# EAGLE design Tag Tracker_v1 (EAGLE 7.3.0)
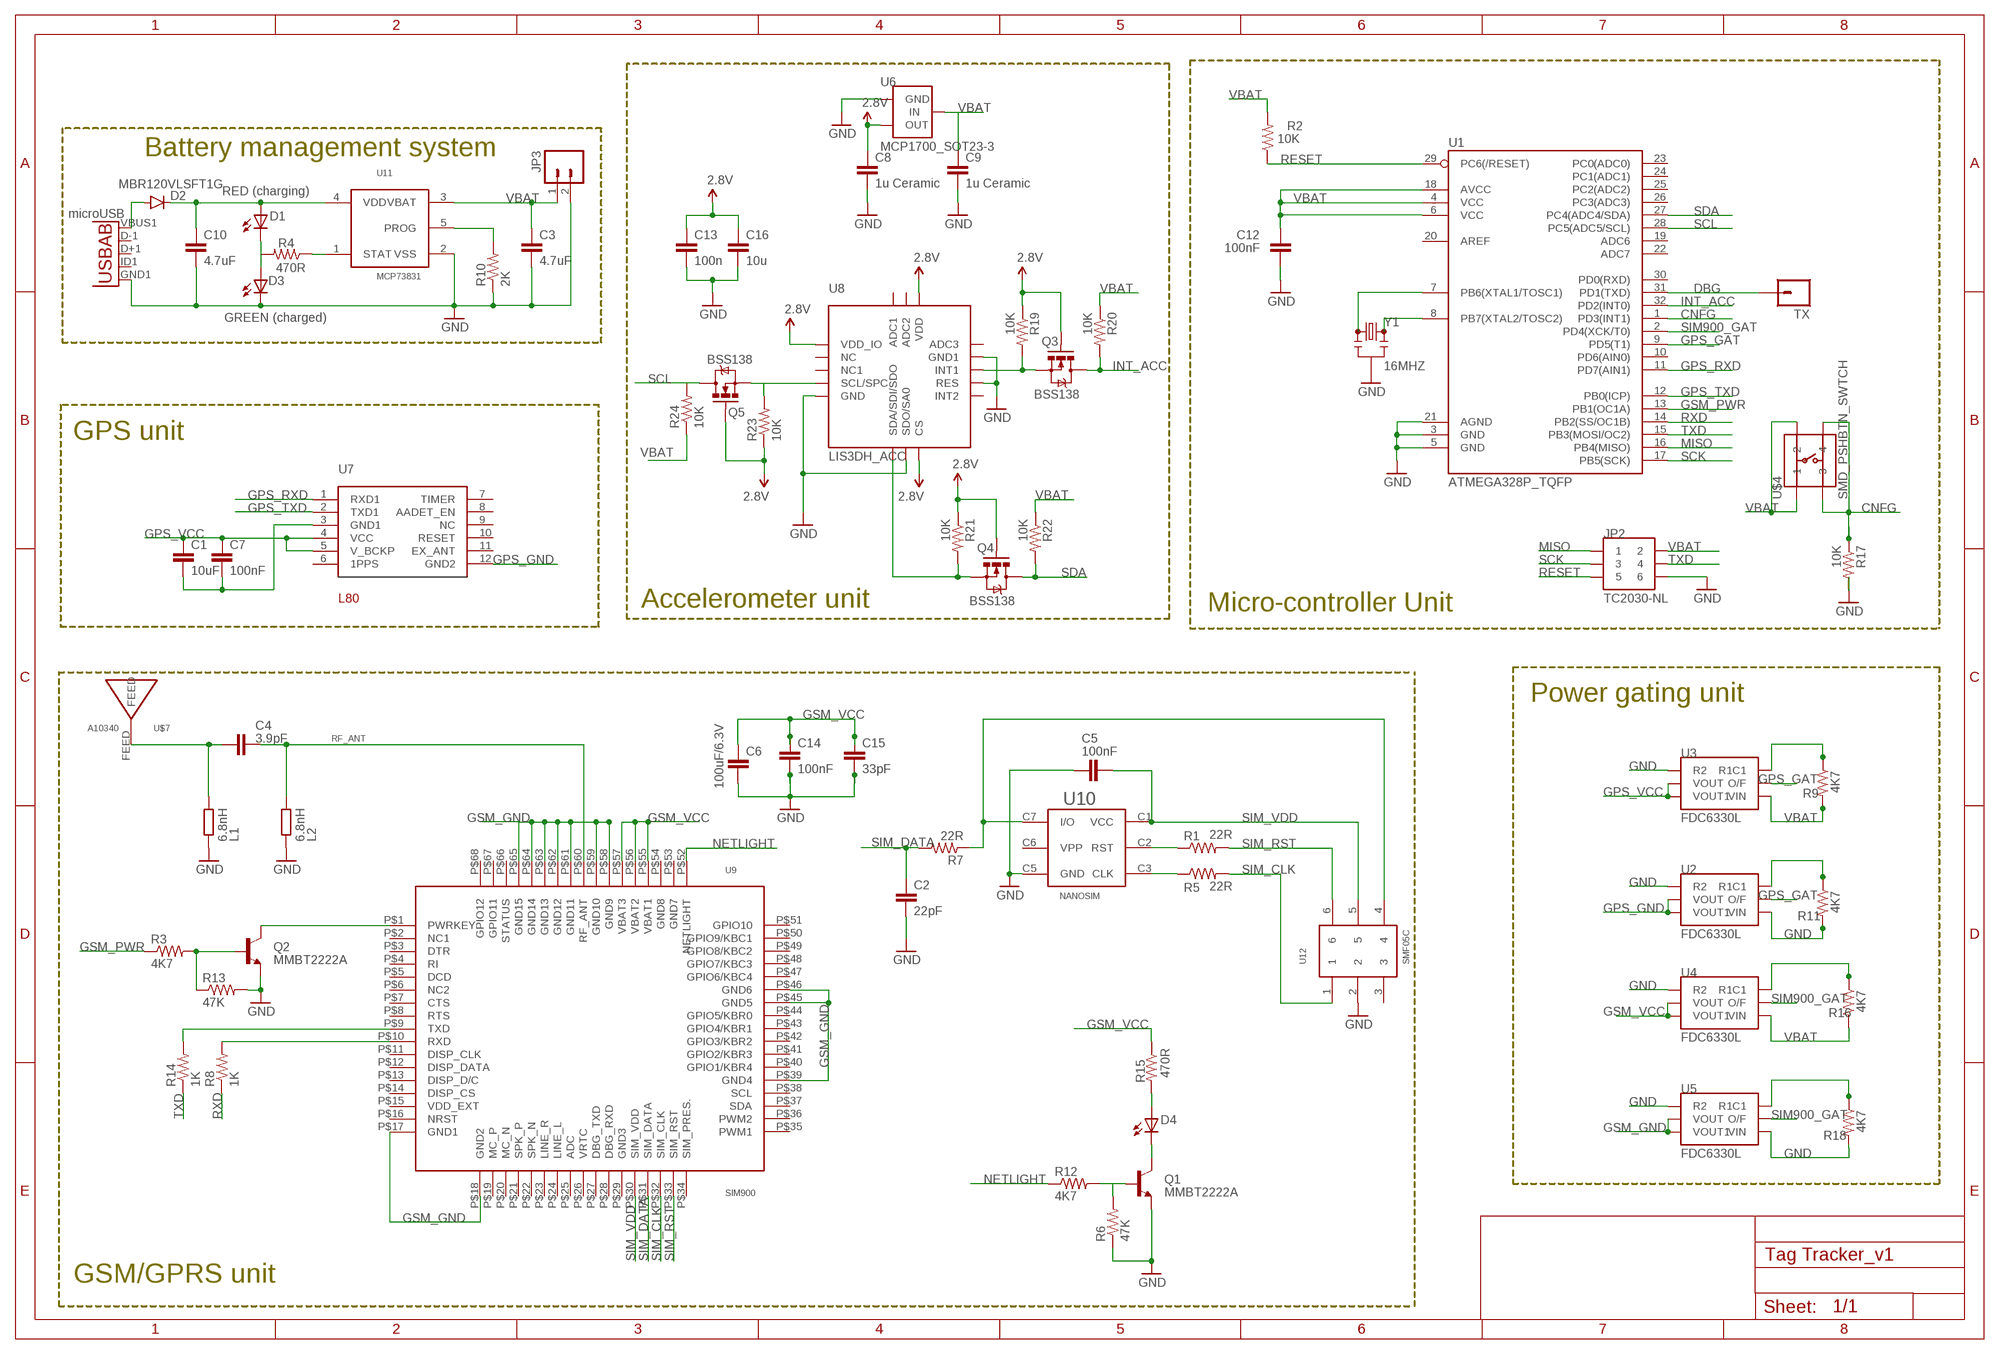
[diagram p0: schematic, sheet 1]

## Parts
C1  10uF  CAP0603-CAP  [0603-CAP]
C2  22pF  CAP0603-CAP  [0603-CAP]
C3  4.7uF  CAP0603-CAP  [0603-CAP]
C4  3.9pF  C-EU0603-RND  [C0603-ROUND]
C5  100nF  CAP0603-CAP  [0603-CAP]
C6  100uF/6.3V  CAP1206  [1206]
C7  100nF  CAP0603-CAP  [0603-CAP]
C8  1u Ceramic  0.1UF-100V-10%(0603)  [0603-CAP]
C9  1u Ceramic  0.1UF-100V-10%(0603)  [0603-CAP]
C10  4.7uF  CAP0603-CAP  [0603-CAP]
C12  100nF  CAP0603-CAP  [0603-CAP]
C13  100n  0.1UF-100V-10%(0603)  [0603-CAP]
C14  100nF  CAP0603-CAP  [0603-CAP]
C15  33pF  CAP0603-CAP  [0603-CAP]
C16  10u  0.1UF-100V-10%(0603)  [0603-CAP]
D1  RED (charging)  LEDSML0603  [SML0603]
D2  MBR120VLSFT1G  DIODESOD123  [SOD-123]
D3  GREEN (charged)  LEDSML0603  [SML0603]
D4  LEDSML0603  [SML0603]
JP2  TC2030-NL  [TC2030-NL]
JP3  M02PTH  [1X02]
L1  6.8nH  R-EU_0603-RND  [R0603-ROUND]
L2  6.8nH  R-EU_0603-RND  [R0603-ROUND]
MICRO_USB  Micro USB  USB-ABCONN-11794  [USB-AB-MICRO-SMD_V03]
Q1  MMBT2222A  TRANSISTOR_NPNMMBT2222A  [SOT23-3]
Q2  MMBT2222A  TRANSISTOR_NPNMMBT2222A  [SOT23-3]
Q3  BSS138  MOSFET-NCHANNELSMD  [SOT23-3]
Q4  BSS138  MOSFET-NCHANNELSMD  [SOT23-3]
Q5  BSS138  MOSFET-NCHANNELSMD  [SOT23-3]
R1  22R  RESISTOR0603-RES  [0603-RES]
R2  10K  RESISTOR0603-RES  [0603-RES]
R3  4K7  RESISTOR0603-RES  [0603-RES]
R4  470R  RESISTOR0603-RES  [0603-RES]
R5  22R  RESISTOR0603-RES  [0603-RES]
R6  47K  RESISTOR0603-RES  [0603-RES]
R7  22R  RESISTOR0603-RES  [0603-RES]
R8  1K  RESISTOR0603-RES  [0603-RES]
R9  4K7  RESISTOR0603-RES  [0603-RES]
R10  2K  RESISTOR0603-RES  [0603-RES]
R11  4K7  RESISTOR0603-RES  [0603-RES]
R12  4K7  RESISTOR0603-RES  [0603-RES]
R13  47K  RESISTOR0603-RES  [0603-RES]
R14  1K  RESISTOR0603-RES  [0603-RES]
R15  470R  RESISTOR0603-RES  [0603-RES]
R16  4K7  RESISTOR0603-RES  [0603-RES]
R17  10K  RESISTOR0603-RES  [0603-RES]
R18  4K7  RESISTOR0603-RES  [0603-RES]
R19  10K  RESISTOR0603-RES  [0603-RES]
R20  10K  RESISTOR0603-RES  [0603-RES]
R21  10K  RESISTOR0603-RES  [0603-RES]
R22  10K  RESISTOR0603-RES  [0603-RES]
R23  10K  RESISTOR0603-RES  [0603-RES]
R24  10K  RESISTOR0603-RES  [0603-RES]
TX  M01PTH  [1X01]
U1  ATMEGA328P_TQFP  [TQFP32-08]
U2  FDC6330L  [FDC6330L]
U3  FDC6330L  [FDC6330L]
U4  FDC6330L  [FDC6330L]
U5  FDC6330L  [FDC6330L]
U6  MCP1700_SOT23-3  [MCP1700_SOT23-3]
U7  L80  [L80]
U8  LIS3DH_ACC  [LIS3DH_ACC]
U9  SIM900  [SIM900]
U10  NANOSIM  [NANOSIM]
U11  MCP73831  [SOT23-5]
U12  SMF05C  [SC70-6]
U$4  SMD_PSHBTN_SWTCH  [KPT-1187B]
U$7  A10340  CALVUS_5BAND_SMD_A103400MM_EXCLUSION  [CALVUS_5BAND_SMD_A10340_0MM_EXCLUSION]
Y1  16MHZ  RESONATOR16MHZ  [RESONATOR-SMD]

## Nets
2.8V: C8.1 C13.1 C16.1 Q3.1(G) Q4.1(G) Q5.1(G) R19.1 R21.1 R23.1 U6.P$2(OUT) U8.P$1(VDD_IO) U8.P$8(CS) U8.P$14(VDD)
CNFG: R17.1 U1.1(PD3(INT1)) U$4.P$3 U$4.P$4
DBG: TX.1 U1.31(PD1(TXD))
GND: C2.2 C3.2 C5.2 C6.2 C8.2 C9.2 C10.2 C12.2 C13.2 C14.2 C15.2 C16.2 D3.C JP2.P$6 JP3.2 L1.1 L2.1 MICRO_USB.GND1(GND) Q1.2(E) Q2.2(E) R6.1 R10.1 R11.2 R13.2 R17.2 R18.2 U1.3(GND) U1.5(GND) U1.21(AGND) U2.P$1(R2) U2.P$4(VIN) U3.P$1(R2) U4.P$1(R2) U5.P$1(R2) U5.P$4(VIN) U6.P$1(GND) U8.P$5(GND) U8.P$7(SDO/SA0) U8.P$10(RES) U8.P$12(GND1) U10.C5(GND) U11.2(VSS) U12.2 Y1.2
GPS_GAT: U1.9(PD5(T1)) U2.P$5(O/F) U3.P$5(O/F)
GPS_GND: C1.2 C7.2 U2.P$2(VOUT) U2.P$3(VOUT1) U7.3(GND1) U7.12(GND2)
GPS_RXD: U1.11(PD7(AIN1)) U7.1(RXD1)
GPS_TXD: U1.12(PB0(ICP)) U7.2(TXD1)
GPS_VCC: C1.1 C7.1 U3.P$2(VOUT) U3.P$3(VOUT1) U7.4(VCC) U7.5(V_BCKP)
GSM_GND: U5.P$2(VOUT) U5.P$3(VOUT1) U9.P$17(GND1) U9.P$18(GND2) U9.P$39(GND4) U9.P$45(GND5) U9.P$46(GND6) U9.P$58(GND9) U9.P$59(GND10) U9.P$61(GND11) U9.P$62(GND12) U9.P$63(GND13) U9.P$64(GND14) U9.P$65(GND15)
GSM_PWR: R3.1 U1.13(PB1(OC1A))
GSM_VCC: C6.1 C14.1 C15.1 R15.1 U4.P$2(VOUT) U4.P$3(VOUT1) U9.P$55(VBAT1) U9.P$56(VBAT2) U9.P$57(VBAT3)
INT_ACC: Q3.3(D) R20.2 U1.32(PD2(INT0))
MISO: JP2.P$1 U1.16(PB4(MISO))
N$1: R7.1 U10.C7(I/O) U12.4
N$2: Q2.1(B) R3.2 R13.1
N$3: R1.1 U10.C2(RST)
N$5: U1.8(PB7(XTAL2/TOSC2)) Y1.3
N$7: R5.1 U10.C3(CLK)
N$8: U1.7(PB6(XTAL1/TOSC1)) Y1.1
N$9: R9.1 U3.P$6(R1C1)
N$10: R8.2 U9.P$10(RXD)
N$12: R14.2 U9.P$9(TXD)
N$13: Q2.3(C) U9.P$1(PWRKEY)
N$14: R4.1 U11.1(STAT)
N$15: R11.1 U2.P$6(R1C1)
N$16: R10.2 U11.5(PROG)
N$17: D1.C D3.A R4.2
N$18: D2.A MICRO_USB.VBUS1(VBUS)
N$20: C4.2 L1.2 U$7.FEED
N$22: C10.1 D1.A D2.C U11.4(VDD)
N$27: Q1.1(B) R6.2 R12.2
N$30: R16.1 U4.P$6(R1C1)
N$39: R18.1 U5.P$6(R1C1)
N$40: D4.C Q1.3(C)
N$41: D4.A R15.2
N$43: Q3.2(S) R19.2 U8.P$11(INT1)
N$46: Q4.2(S) R21.2 U8.P$6(SDA/SDI/SDO)
N$48: Q5.2(S) R23.2 U8.P$4(SCL/SPC)
NETLIGHT: R12.1 U9.P$52(NETLIGHT)
RESET: JP2.P$5 R2.1 U1.29(PC6(/RESET))
RF_ANT [PWR]: C4.1 L2.2 U9.P$60(RF_ANT)
RXD: R8.1 U1.14(PB2(SS/OC1B))
SCK: JP2.P$3 U1.17(PB5(SCK))
SCL: Q5.3(D) R24.2 U1.28(PC5(ADC5/SCL))
SDA: Q4.3(D) R22.2 U1.27(PC4(ADC4/SDA))
SIM900_GAT: U1.2(PD4(XCK/T0)) U4.P$5(O/F) U5.P$5(O/F)
SIM_CLK: R5.2 U9.P$32(SIM_CLK) U12.1
SIM_DATA: C2.1 R7.2 U9.P$31(SIM_DATA)
SIM_RST: R1.2 U9.P$33(SIM_RST) U12.6
SIM_VDD: C5.1 U9.P$30(SIM_VDD) U10.C1(VCC) U12.5
TXD: JP2.P$4 R14.1 U1.15(PB3(MOSI/OC2))
VBAT: C3.1 C9.1 C12.1 JP2.P$2 JP3.1 R2.2 R9.2 R16.2 R20.1 R22.1 R24.1 U1.4(VCC) U1.6(VCC) U1.18(AVCC) U3.P$4(VIN) U4.P$4(VIN) U6.P$3(IN) U11.3(VBAT) U$4.P$1 U$4.P$2
Unconnected: MICRO_USB.D+1(D+) MICRO_USB.D-1(D-) MICRO_USB.ID1(USBID) U1.10(PD6(AIN0)) U1.19(ADC6) U1.20(AREF) U1.22(ADC7) U1.23(PC0(ADC0)) U1.24(PC1(ADC1)) U1.25(PC2(ADC2)) U1.26(PC3(ADC3)) U1.30(PD0(RXD)) U7.6(1PPS) U7.7(TIMER) U7.8(AADET_EN) U7.9(NC) U7.10(RESET) U7.11(EX_ANT) U8.P$2(NC) U8.P$3(NC1) U8.P$9(INT2) U8.P$13(ADC3) U8.P$15(ADC2) U8.P$16(ADC1) U9.P$2(NC1) U9.P$3(DTR) U9.P$4(RI) U9.P$5(DCD) U9.P$6(NC2) U9.P$7(CTS) U9.P$8(RTS) U9.P$11(DISP_CLK) U9.P$12(DISP_DATA) U9.P$13(DISP_D/C) U9.P$14(DISP_CS) U9.P$15(VDD_EXT) U9.P$16(NRST) U9.P$19(MC_P) U9.P$20(MC_N) U9.P$21(SPK_P) U9.P$22(SPK_N) U9.P$23(LINE_R) U9.P$24(LINE_L) U9.P$25(ADC) U9.P$26(VRTC) U9.P$27(DBG_TXD) U9.P$28(DBG_RXD) U9.P$29(GND3) U9.P$34(SIM_PRES.) U9.P$35(PWM1) U9.P$36(PWM2) U9.P$37(SDA) U9.P$38(SCL) U9.P$40(GPIO1/KBR4) U9.P$41(GPIO2/KBR3) U9.P$42(GPIO3/KBR2) U9.P$43(GPIO4/KBR1) U9.P$44(GPIO5/KBR0) U9.P$47(GPIO6/KBC4) U9.P$48(GPIO7/KBC3) U9.P$49(GPIO8/KBC2) U9.P$50(GPIO9/KBC1) U9.P$51(GPIO10) U9.P$53(GND7) U9.P$54(GND8) U9.P$66(STATUS) U9.P$67(GPIO11) U9.P$68(GPIO12) U10.C6(VPP) U12.3

## Notes on the sheet
- Battery management system
- microUSB
- GPS unit
- Accelerometer unit | Micro-controller Unit
- Power gating unit
- RF_ANT
- GSM/GPRS unit

## Library data of the parts
C1-C3 C5-C7 C10 C12 C14 C15 = SparkFun-Capacitors:CAP: Capacitor Standard 0603 ceramic capacitor, and 0.1" leaded capacitor.
C4 = SmartPrj:C-EU: CAPACITOR, European symbol; OC_FARNELL: unknown
C8 C9 C13 C16 = SparkFun-Capacitors:0.1UF-100V-10%(0603): CAP-08390; PROD_ID: CAP-08390; VALUE: 0.1uF
D1 D3 D4 = led:LED: LED OSRAM: - CHIPLED LG R971, LG N971, LY N971, LG Q971, LY Q971, LO R971, LY R971 LH N974, LH R974 LS Q976, LO Q976, LY Q976 LO Q996 - Hyper CHIPLED LW Q18S LB Q993, LB Q99A, LB R99A - SideLED LS A670, LO A670, LY A670, LG A670, LP A670 LB A673, LV A673, LT A673, LW A673 LH A674 LY A675 LS A676, LA A676, LO A676, LY A676, LW A676 LS A679, LY A679, LG A679 - Hyper Micro SIDELED® LS Y876, LA Y876, LO Y876, LY Y876 LT Y87S - SmartLED LW L88C, LW L88S LB L89C, LB L89S, LG L890 LS L89K, LO L89K, LY L89K LS L896, LA L896, LO L896, LY L896 - TOPLED LS T670, LO T670, LY T670, LG T670, LP T670 LSG T670, LSP T670, LSY T670, LOP T670, LYG T670 LG T671, LOG T671, LSG T671 LB T673, LV T673, LT T673, LW T673 LH T674 LS T676, LA T676, LO T676, LY T676, LB T676, LH T676, LSB T676, LW T676 LB T67C, LV T67C, LT T67C, LS T67K, LO T67K, LY T67K, LW E67C LS E67B, LA E67B, LO E67B, LY E67B, LB E67C, LV E67C, LT E67C LW T67C LS T679, LY T679, LG T679 LS T770, LO T770, LY T770, LG T770, LP T770 LB T773, LV T773, LT T773, LW T773 LH T774 LS E675, LA E675, LY E675, LS T675 LS T776, LA T776, LO T776, LY T776, LB T776 LHGB T686 LT T68C, LB T68C - Hyper Mini TOPLED® LB M676 - Mini TOPLED Santana® LG M470 LS M47K, LO M47K, LY M47K Source: http://www.osram.convergy.de LUXEON: - LUMILED® LXK2-PW12-R00, LXK2-PW12-S00, LXK2-PW14-U00, LXK2-PW14-V00 LXK2-PM12-R00, LXK2-PM12-S00, LXK2-PM14-U00 LXK2-PE12-Q00, LXK2-PE12-R00, LXK2-PE12-S00, LXK2-PE14-T00, LXK2-PE14-U00 LXK2-PB12-K00, LXK2-PB12-L00, LXK2-PB12-M00, LXK2-PB14-N00, LXK2-PB14-P00, LXK2-PB14-Q00 LXK2-PR12-L00, LXK2-PR12-M00, LXK2-PR14-Q00, LXK2-PR14-R00 LXK2-PD12-Q00, LXK2-PD12-R00, LXK2-PD12-S00 LXK2-PH12-R00, LXK2-PH12-S00 LXK2-PL12-P00, LXK2-PL12-Q00, LXK2-PL12-R00 Source: www.luxeon.com KINGBRIGHT: KA-3528ASYC Source: www.kingbright.com
D2 = SparkFun-DiscreteSemi:DIODE: Diode These are standard reverse protection diodes and small signal diodes. SMA package can handle up to about 1A. SOD-323 can handle about 200mA. What the SOD-323 package when ordering, there are some mfgs out there that are 5-pin packages.
JP2 = Various_parts:TC2030-NL
JP3 = SparkFun-Connectors:M02: Standard 2-pin 0.1" header. Use with - straight break away headers ( PRT-00116) - right angle break away headers (PRT-00553) - swiss pins (PRT-00743) - machine pins (PRT-00117) - female headers (PRT-00115) Molex polarized connector foot print use with: PRT-08233 with associated crimp pins and housings. 2.54_SCREWTERM for use with PRT-10571. 3.5mm Screw Terminal footprints for PRT-08084 5mm Screw Terminal footprints for use with PRT-08432
L1 L2 = SmartPrj:R-EU_: RESISTOR, European symbol; OC_FARNELL: unknown
MICRO_USB = SparkFun-Connectors:USB-AB: This is a USB AB connector that is compatible with USB OTG. i.e. this connector can serve as a host or device; PROD_ID: CONN-11794
Q1 Q2 = SparkFun-DiscreteSemi:TRANSISTOR_NPN: Generic NPN BJT MMBT2222A - TRANS-08049 (SOT-23, 1A 40V) MPSA42 - TRANS-09116 (SOT-23, 500mA 300V) MMBT5088LT1G - TRANS-11160 (SOT-23, 50 mA 30V) BC547 - COM-08928 <http://www.sparkfun.com/products/8928> (TO-92 45V 100mA) (1.Collector 2.Base 3.Emitter) 2N3904 - COM-00521 <http://www.sparkfun.com/products/521> (TO-92 40V 200mA) (1.Emitter 2.Base 3.Collector) P2N2222A - COM-12852 <http://www.sparkfun.com/products/12852> (TO-92 40V 600mA) (1.Collector 2.Base 3.Emitter); PROD_ID: TRANS-08049
Q3-Q5 = SparkFun:MOSFET-NCHANNEL
R1-R6 R8 R10 R12-R15 = SparkFun-Resistors:RESISTOR: Resistor Basic schematic elements and footprints for 0603, 1206, and PTH resistors.
R7 R9 R11 R16-R18 = SparkFun-Resistors:RESISTOR: Resistor Basic schematic elements and footprints for 0603, 1206, and PTH resistors.; OC_FARNELL: unknown
R19-R24 = SparkFun:RESISTOR: Resistor Basic schematic elements and footprints for 0603, 1206, and PTH resistors.
TX = SparkFun-Connectors:M01: Header 1 Standard 1-pin 0.1" header. Use with straight break away headers (SKU : PRT-00116), right angle break away headers (PRT-00553), swiss pins (PRT-00743), machine pins (PRT-00117), and female headers (PRT-00115). SMTSO-256-ET is a "flush mount" nut for a 4-40 screw. The older package used to be too tight, and did not allow it to sit properly thru the drill hit. The latest (0.165DIA) fits nice and snug.
U1 = SparkFun-DigitalIC:ATMEGA328P_TQFP; PROD_ID: IC-09069
U2-U5 = Various_parts:FDC6330L; OC_MOUSER: 512-FDC6330L
U6 = Various_parts:MCP1700_SOT23-3; OC_MOUSER: 579-MCP1700T3302E/TT
U7 = myLibraries:L80
U8 = Various_parts:LIS3DH_ACC; OC_MOUSER: 511-LIS3DHTR
U9 = myLibraries:SIM900
U10 = myLibraries:NANOSIM
U11 = myLibraries:MCP73831
U12 = myLibraries:SMF05C
U$4 = Sensor_Node:SMD_PSHBTN_SWTCH: SMD Mini Pushbutton Switch (https://www.sparkfun.com/products/8720) Created 12 February 2015 by Bojan Jovanovic; OC_SPARKFUN: COM-08720
U$7 = SmartPrj:CALVUS_5BAND_SMD_A10340; OC_FARNELL: unknown
Y1 = myLibraries:RESONATOR: Resonator Small SMD resonator. Used, eg, on the Arduino Pro/ Pro Mini boards. 8MHz- XTAL-08895 16MHz- XTAL-08900; PROD_ID: XTAL-08900

## Net classes
1 PWR: width 0.203 mm, drill 0.4 mm, clearance 0.076 mm
4 antenna: clearance 0.61 mm

## Board
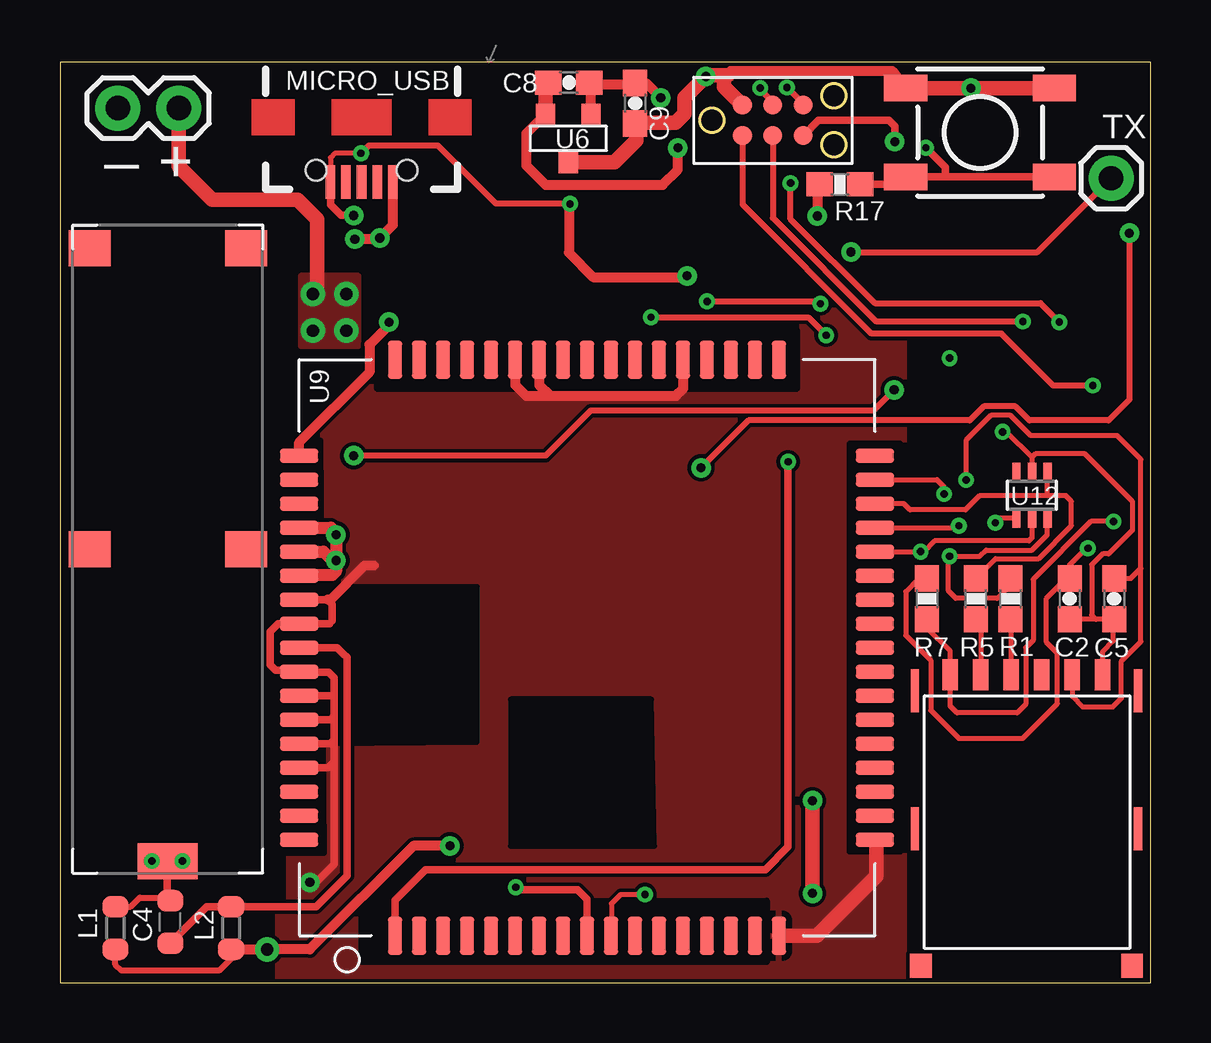
[diagram p1: board, top side]
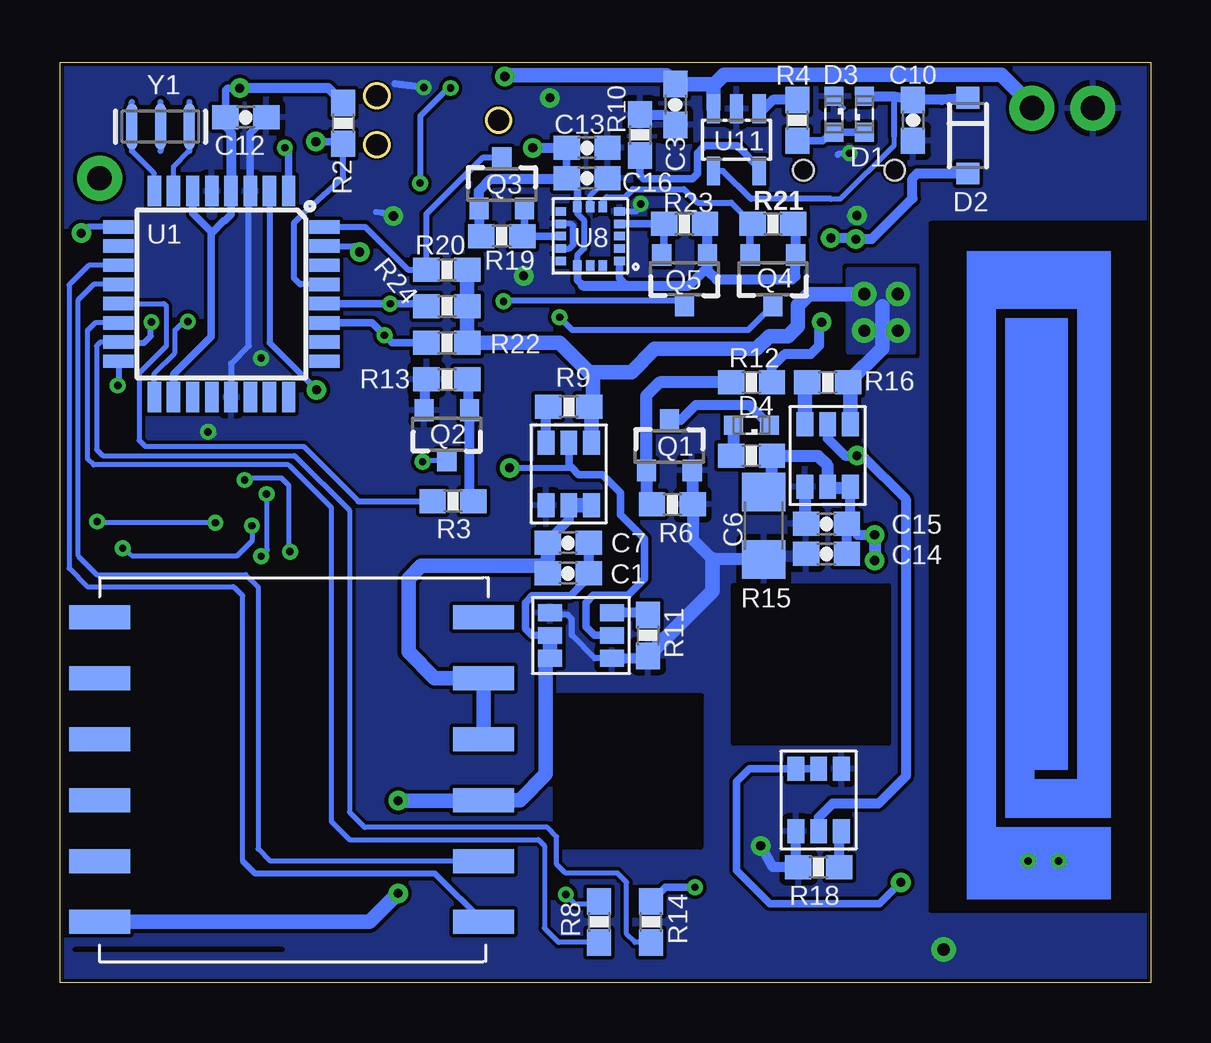
[diagram p2: board, bottom side, seen from below]

Size 45.47 x 38.35 mm. Coordinates in mm from the lower left corner, seen from the top.
Outline: 0,0 45.47,0 45.47,38.35 0,38.35 0,0
Copper layers (1*16): Top 0.035mm / dielectric 1.5mm / Bottom 0.035mm
Design rules "Micron20": minimum track width 8mil, minimum drill 12mil, track to track 6mil, track to pad 6mil, pad to pad 6mil, via to via 6mil, smd to smd 6mil, copper to edge 6mil, drill to drill 6mil, minimum pad ring 7mil, minimum via ring 7mil, stop-mask expansion 4mil, vias tented up to drill 25mil, thermal gap 10mil
bRestrict: area 40.4,34.8 to 40.9,36.6; area 41.7,34.8 to 42.2,36.6

### Footprints (pad centres in the part's own frame; a part is rotated, then mirrored left to right if it is on the bottom)
0603-CAP = smd 1.1 x 1: 1 -0.85,0; 2 0.85,0
C0603-ROUND = smd 0.898 x 1.1: 1 -0.889,0; 2 0.889,0
1206 = smd 1.6 x 1.8: 1 -1.4,0; 2 1.4,0
SML0603 = smd 0.8 x 0.8: A 0.75,0; C -0.75,0
SOD-123 = smd 0.9 x 0.95: A 1.575,0; C -1.575,0
TC2030-NL = smd 0.8 x 0.8: P$1 -1.27,-0.635; P$2 -1.27,0.635; P$3 0,-0.635; P$4 0,0.635; P$5 1.27,-0.635; P$6 1.27,0.635 | hole 1: -2.54,0; 2.54,1.016; 2.54,-1.016
1X02 = drill 1.016 pad 1.88: 1 0,0; 2 2.54,0
R0603-ROUND = smd 0.898 x 1.1: 1 -0.889,0; 2 0.889,0
USB-AB-MICRO-SMD_V03 = smd 1.4 x 0.4: D+1 2.7,0; D-1 2.7,0.65; GND1 2.7,-1.3; ID1 2.7,-0.65; VBUS1 2.7,1.3 | hole 0.85: 2.2,1.9; 2.2,-1.9
SOT23-3 = smd 0.8 x 0.9: 1 -0.95,-1; 2 0.95,-1; 3 0,1.1
0603-RES = smd 1.1 x 1: 1 -0.85,0; 2 0.85,0
1X01 = drill 1.016 pad 1.88: 1 0,0
TQFP32-08 = smd 1.27 x 0.559: 1 -4.293,2.8; 2 -4.293,2; 3 -4.293,1.2; 4 -4.293,0.4; 5 -4.293,-0.4; 6 -4.293,-1.2; 7 -4.293,-2; 8 -4.293,-2.8; 17 4.293,-2.8; 18 4.293,-2; 19 4.293,-1.2; 20 4.293,-0.4; 21 4.293,0.4; 22 4.293,1.2; 23 4.293,2; 24 4.293,2.8 | smd 0.559 x 1.27: 9 -2.8,-4.293; 10 -2,-4.293; 11 -1.2,-4.293; 12 -0.4,-4.293; 13 0.4,-4.293; 14 1.2,-4.293; 15 2,-4.293; 16 2.8,-4.293; 25 2.8,4.293; 26 2,4.293; 27 1.2,4.293; 28 0.4,4.293; 29 -0.4,4.293; 30 -1.2,4.293; 31 -2,4.293; 32 -2.8,4.293
FDC6330L = smd 0.7 x 1: P$1 -0.95,-1.3; P$2 0,-1.3; P$3 0.95,-1.3; P$4 0.95,1.3; P$5 0,1.3; P$6 -0.95,1.3
MCP1700_SOT23-3 = smd 0.8 x 0.9: P$1 0.95,2; P$2 -0.95,2; P$3 0,0
L80 = smd 2.54 x 1: 1 8,-6.35; 2 8,-3.81; 3 8,-1.27; 4 8,1.27; 5 8,3.81; 6 8,6.35; 7 -8,6.35; 8 -8,3.81; 9 -8,1.27; 10 -8,-1.27; 11 -8,-3.81; 12 -8,-6.35
LIS3DH_ACC = smd 0.45 x 0.35: P$1 -1.225,1.03; P$2 -1.225,0.515; P$3 -1.225,0; P$4 -1.225,-0.515; P$5 -1.225,-1.03; P$9 1.225,-1.03; P$10 1.225,-0.515; P$11 1.225,0; P$12 1.225,0.515; P$13 1.225,1.03 | smd 0.35 x 0.45: P$6 -0.53,-1.225; P$7 0,-1.225; P$8 0.53,-1.225; P$14 0.53,1.225; P$15 0,1.225; P$16 -0.53,1.225
SIM900 = smd 1.6 x 0.6: P$1 -12,8; P$2 -12,7; P$3 -12,6; P$4 -12,5; P$5 -12,4; P$6 -12,3; P$7 -12,2; P$8 -12,1; P$9 -12,0; P$10 -12,-1; P$11 -12,-2; P$12 -12,-3; P$13 -12,-4; P$14 -12,-5; P$15 -12,-6; P$16 -12,-7; P$17 -12,-8; P$35 12,-8; P$36 12,-7; P$37 12,-6; P$38 12,-5; P$39 12,-4; P$40 12,-3; P$41 12,-2; P$42 12,-1; P$43 12,0; P$44 12,1; P$45 12,2; P$46 12,3; P$47 12,4; P$48 12,5; P$49 12,6; P$50 12,7; P$51 12,8 | smd 0.6 x 1.6: P$18 -8,-12; P$19 -7,-12; P$20 -6,-12; P$21 -5,-12; P$22 -4,-12; P$23 -3,-12; P$24 -2,-12; P$25 -1,-12; P$26 0,-12; P$27 1,-12; P$28 2,-12; P$29 3,-12; P$30 4,-12; P$31 5,-12; P$32 6,-12; P$33 7,-12; P$34 8,-12; P$52 8,12; P$53 7,12; P$54 6,12; P$55 5,12; P$56 4,12; P$57 3,12; P$58 2,12; P$59 1,12; P$60 0,12; P$61 -1,12; P$62 -2,12; P$63 -3,12; P$64 -4,12; P$65 -5,12; P$66 -6,12; P$67 -7,12; P$68 -8,12
NANOSIM = smd 0.65 x 1.3: C1 1.905,6.42; C2 -0.635,6.42; C3 -1.905,6.42; C5 3.175,6.42; C6 0.635,6.42; C7 -3.175,6.42 | smd 0.35 x 1.8: P$7 -4.65,0; P$8 4.65,0; P$9 -4.65,5.75; P$10 4.65,5.75 | smd 0.9 x 1: P$11 -4.4,-5.72; P$12 4.4,-5.72
SOT23-5 = smd 0.55 x 1.2: 1 -0.95,-1.3; 2 0,-1.3; 3 0.95,-1.3; 4 0.95,1.3; 5 -0.95,1.3
SC70-6 = smd 0.35 x 0.8: 1 -0.65,-0.95; 2 0,-0.95; 3 0.65,-0.95; 4 0.65,0.95; 5 0,0.95; 6 -0.65,0.95
KPT-1187B = smd 1.8 x 1.1: P$1 -3.1,1.85; P$2 3.1,1.85; P$3 -3.1,-1.85; P$4 3.1,-1.85
CALVUS_5BAND_SMD_A10340_0MM_EXCLUSION = smd 2.5 x 1.5: FEED 3.95,0.5 | smd 1.75 x 1.5: FIXINGPOINT$1 0.7,26.05; FIXINGPOINT$2 7.22,26.05; FIXINGPOINT$3 0.7,13.49; FIXINGPOINT$4 7.22,13.49
RESONATOR-SMD = smd 0.45 x 1.905: 1 -1.2,0; 2 0,0; 3 1.2,0

### Placement (x,y rotation side)
C1  24.28,17.07 0 bottom
C2  42.09,16 270 top
C3  19.81,36.6 270 bottom
C4  4.6,2.54 90 top
C5  43.94,16 270 top
C6  16.13,19.05 270 bottom
C7  24.28,18.34 0 bottom
C8  21.21,37.52 0 top
C9  23.98,36.65 90 top
C10  9.91,35.94 270 bottom
C12  37.72,36.07 0 bottom
C13  23.5,34.8 0 bottom
C14  13.51,17.88 180 bottom
C15  13.51,19.13 180 bottom
C16  23.5,33.53 0 bottom
D1  11.94,36.2 90 bottom
D2  7.62,35.31 270 bottom
D3  13.21,36.2 270 bottom
D4  16.64,23.24 180 bottom
JP2  29.72,35.94 0 top
JP3  4.95,36.45 180 top
L1  2.31,2.29 90 top
L2  7.14,2.29 90 top
MICRO_USB  12.57,36.07 270 top
Q1  20.07,22.35 0 bottom
Q2  29.34,22.86 180 bottom
Q3  27.05,33.27 0 bottom
Q4  15.75,29.34 180 bottom
Q5  19.43,29.34 180 bottom
R1  39.62,16 90 top
R2  33.66,35.81 90 bottom
R3  29.08,20.07 0 bottom
R4  14.73,35.94 270 bottom
R5  38.18,16 90 top
R6  19.94,19.94 180 bottom
R7  36.14,16 90 top
R8  22.99,2.54 90 bottom
R9  24.26,24 0 bottom
R10  21.29,35.33 270 bottom
R11  20.95,14.48 270 bottom
R12  16.64,25.02 180 bottom
R13  29.34,25.15 180 bottom
R14  20.83,2.54 90 bottom
R15  16.64,21.97 180 bottom
R16  13.46,25.02 0 bottom
R17  32.51,33.27 180 top
R18  13.84,4.83 180 bottom
R19  27.05,31.11 0 bottom
R20  29.34,29.72 180 bottom
R21  15.75,31.62 180 bottom
R22  29.34,26.67 180 bottom
R23  19.43,31.62 180 bottom
R24  29.34,28.19 180 bottom
TX  43.81,33.53 0 top
U1  38.73,28.7 270 bottom
U2  23.75,14.48 270 bottom
U3  24.26,21.21 0 bottom
U4  13.46,21.97 0 bottom
U5  13.84,7.62 180 bottom
U6  21.18,34.19 0 top
U7  35.81,8.89 0 bottom
U8  23.37,31.11 180 bottom
U9  21.97,13.97 90 top
U10  40.28,6.43 0 top
U11  17.27,35.13 180 bottom
U12  40.51,20.32 180 top
U$4  38.35,35.43 0 top
U$7  0.53,4.57 0 top
Y1  41.27,35.69 180 bottom

### Tracks (layer width: path | path; a pad name or v marks a point on that pad's centre or on a via)
2.8V  (via drill 0.38 pad 0.81)
  Top 0.406: v25.76,34.8 25.76,33.88 25.12,33.25 20.24,33.25 19.43,34.06 19.43,35.39 U6.P$2
  Top 0.61: U6.P$2 20.23,37.39 C8.1
  Bottom 0.254: R23.1 18.56,31.6 | U8.P$14 23.9,30.33 23.62,30.61 23.62,31.77 23.9,32.05 U8.P$8
  Bottom 0.305: 14.8,31.52 R21.1 | U8.P$14 23.9,29.28 23.67,29.06 | U8.P$1 22.14,29.36 21.84,29.06 | U8.P$8 23.9,33.08 C16.1 C13.1
  Bottom 0.406: 14.8,31.52 Q4.1 14.81,30.33 14.81,29.44 14.94,29.31 18.11,29.31 18.48,29.68 18.48,29.82 | 18.48,29.82 Q5.1 18.48,31.52 R23.1 | 23.67,29.06 21.84,29.06 19.24,29.06 18.48,29.82 | C16.1 24.34,33.48 27.53,33.48 28.02,32.99 28.02,32.29 Q3.1 28,31.21 R19.1 | v25.76,34.8 C13.1
CNFG  (via drill 0.3 pad 0.61)
  Top 0.305: U$4.P$3 34.95,33.27 R17.1 | U$4.P$4 36.91,33.58 | 36.91,33.58 U$4.P$3 | U$4.P$3 35.25,33.96 | v36.09,34.8 36.91,33.98 36.91,33.58
  Bottom 0.305: v36.09,34.8 35.94,34.64 U1.1
DBG  (via drill 0.38 pad 0.81)
  Top 0.254: v32.97,30.45 40.74,30.45 TX.1
  Bottom 0.254: U1.31 33.22,30.7 v32.97,30.45
GND  (via drill 0.3 pad 0.51, 0.3 pad 0.61, 0.38 pad 0.81, 0.51 pad 1.02)
  Top 0.203: 40.51,21.89 40.66,22.05 42.72,22.05 44.7,20.07 44.7,18.87 43.71,17.88 43.46,17.88 43,17.42 43,15.33 43.18,15.15 | 40.51,21.89 U12.2 | 40.51,21.89 39.5,22.91 v39.29,22.96 | v12.55,34.57 11.46,34.57 11.28,34.39 MICRO_USB.GND1 | U10.C5 43.46,13.79 43.92,14.25 43.92,15.13 C5.2 43.18,15.15 | 43.18,15.15 C2.2
  Top 0.254: L2.1 7.14,1.02 6.63,0.51 2.56,0.51 2.31,0.76 L1.1 | JP2.P$6 30.99,36.63 v30.3,37.31 | 21.21,32.51 v21.26,32.46 21.23,32.49 18.16,32.49 15.75,34.9 12.88,34.9 v12.55,34.57
  Top 0.305: MICRO_USB.GND1 11.27,32.41 11.71,31.98 v12.24,31.98
  Top 0.406: L2.1 v8.64,1.4 10.41,1.4 14.73,5.71 v16.26,5.71 | U6.P$1 22.13,37.44 | 22.13,37.44 C8.2 | v25.04,36.88 24.42,37.5 C9.2 23.92,37.44 22.13,37.44 | 21.21,32.51 21.21,30.43 22.23,29.41 26.09,29.41 v26.14,29.46 | R17.2 31.57,33.18 v31.57,31.95
  Bottom 0.203: 37.53,33.59 U1.3 37.59,32.94 | v39.29,22.96 39.04,22.91 39.04,22.86 | U8.P$7 23.37,32.8 C16.2 | D3.C 13.3,36.95 12.8,36.45
  Bottom 0.254: 30.24,23.91 Q2.2 | 37.59,32.94 37.59,26.54 38.34,25.8 U1.21 | v31.57,31.95 32.31,32.13 32,32.11 | U8.P$12 24.24,30.6 24.08,30.76 24.08,31.55 24.16,31.63 U8.P$10 | U2.P$4 23.18,13.53 24.13,14.48 24.13,15.16 24.31,15.34 24.96,15.34 U2.P$1 | U8.P$5 21.45,32.15 21.11,32.49 v21.26,32.46 | v12.55,34.57 12.57,34.54 13.03,34.54 13.06,34.52 13.06,34.49
  Bottom 0.305: C12.2 37.53,35.4 U1.3 | v30.3,37.31 31.5,37.47 | v12.24,31.98 12.5,31.98 12.52,31.95
  Bottom 0.406: 30.24,23.91 30.24,25.1 R13.2 | U2.P$4 21.05,13.53 R11.2 | U5.P$4 14.79,4.93 R18.2 15.75,4.83 v16.26,5.71 | v8.64,1.4 8.89,1.4 | v25.04,36.88 25.09,36.88 25.22,36.75 | R10.1 20.24,36.18 C3.2
  Bottom 0.508: U4.P$1 14.41,19.1 | 16,17.53 C6.2 18.26,17.65 19.05,18.44 19.05,19.9 R6.1 19.09,21.32 Q1.2
  Bottom 0.61: R11.2 18.26,16.32 18.26,17.65
  other vias: 37.08,26.04
  pour Bottom (rank 3): 0,38.35 0,0 45.47,0 45.47,1.91 45.47,38.35
GPS_GAT  (via drill 0.38 pad 0.81)
  Top 0.254: v44.58,31.24 44.58,24.31 43.71,23.44 40.41,23.44 39.83,24.03 38.51,24.03 37.92,23.44 28.7,23.44 v26.72,21.46
  Bottom 0.254: U1.9 44.32,31.5 v44.58,31.24 | v26.72,21.46 24.13,21.46
  Bottom 0.305: U3.P$5 24.26,21.59 24.13,21.46 23.85,21.18 22.86,21.18 22.1,20.42 22.1,19.51 21.11,18.52 21.11,16.84 21.79,16.15 23.24,16.15 23.55,15.85 23.55,14.83 23.19,14.48 U2.P$5
GPS_GND  (via drill 0.38 pad 0.81)
  Top 0.61: v31.37,3.73 v31.37,7.59
  Bottom 0.305: C1.2 23.43,16.88 24.18,16.13 25.78,16.13 26.06,15.85 26.06,14.76 25.78,14.48 U2.P$2
  Bottom 0.406: C7.2 C1.2
  Bottom 0.61: U2.P$2 U2.P$3 25.22,13.36 25.22,8.69 26.29,7.62 U7.3 27.84,7.59 v31.37,7.59 | U7.12 32.56,2.54 v31.37,3.73
GPS_RXD
  Bottom 0.203: 37.85,5.08 37.85,16.13 38.23,16.51 44.32,16.51 45.09,17.27 45.09,29.08 44.27,29.9 U1.11
  Bottom 0.254: U7.1 29.83,4.56 37.33,4.56 37.85,5.08
GPS_TXD
  Bottom 0.203: U7.2 36.7,5.08 37.21,5.59 37.21,16.51 37.72,17.02 43.94,17.02 44.7,17.78 44.7,28.47 44.07,29.1 U1.12
GPS_VCC
  Bottom 0.406: 25.17,18.38 24.26,19.29 U3.P$2
  Bottom 0.61: U7.4 U7.5 29.84,12.7 30.94,13.79 30.94,16.84 30.4,17.37 25.44,17.37 | 25.16,17.04 C1.1 25.44,17.37 | U3.P$3 U3.P$2 | 25.17,18.38 C7.1 25.13,17.68 arc90 25.44,17.37
GSM_GND  (via drill 0.38 pad 0.81)
  Top 0.305: U9.P$65 11.18,8.97 11.43,9.22 | 11.43,9.22 11.43,10.13 | 11.43,10.13 11.43,11.12 | 11.43,11.12 11.43,11.97 | 11.43,11.97 11.43,12.72 11.2,12.95 9.99,12.95 U9.P$61 9.91,13.03 8.99,13.03 8.76,13.26 8.76,14.63 9.1,14.97 U9.P$59 11.24,14.97 11.35,15.09 11.35,15.77 11.16,15.97 U9.P$58 | U9.P$63 11.28,10.97 11.43,11.12 | U9.P$64 11.27,9.97 11.43,10.13 | U9.P$62 11.43,11.97 | 11.43,9.22 11.43,4.95 10.67,4.19 v10.41,4.19
  Top 0.406: U9.P$46 18.97,24.92 19.43,24.46 20.42,24.46 | 20.42,24.46 25.68,24.46 25.98,24.77 25.98,25.96 U9.P$39 | U9.P$45 19.97,24.91 20.42,24.46 | 11.16,15.97 11.27,15.97 12.7,17.4 13.08,17.4
  Top 0.61: U9.P$17 31.56,1.97 34.04,4.45 34.04,5.91 U9.P$18
  Bottom 0.305: v10.41,4.19 11.3,3.3 15.88,3.3 17.27,4.7 17.27,8.38 16.73,8.92 U5.P$3 U5.P$2
  pour Top (rank 6): 9.07,28.14 9.07,-0.03 16.89,-0.03 35.2,-0.03 35.2,24.33 35.2,28.12
GSM_PWR
  Bottom 0.203: U1.13 41.13,28.3 41.02,28.19 41.02,26.54 42.16,25.4 42.16,22.61 41.91,22.35 35.31,22.35 33.02,20.07
  Bottom 0.254: 33.02,20.07 R3.1
GSM_VCC  (via drill 0.38 pad 0.81)
  Top 0.508: U9.P$55 11.28,18.97 11.51,18.75 v11.51,17.6 | v11.51,17.6 11.51,17.45 | 11.51,17.45 11.51,17.14 11.35,16.99 9.99,16.99 U9.P$57 | U9.P$56 10.99,17.97 11.35,17.6 | 11.35,17.6 11.51,17.45 | v11.51,17.6 11.35,17.6
  Bottom 0.406: 12.56,20.62 U4.P$3 12.51,19.28 C15.1 | C14.1 C15.1 | C15.1 12.21,18.67 v11.51,18.67
  Bottom 0.508: 12.56,20.62 13.41,20.62 U4.P$2 13.46,21.54 13.87,21.95 15.76,21.95 R15.1 15.79,20.79 C6.1 | 11.58,17.53 v11.51,17.6 v11.51,18.67
INT_ACC
  Bottom 0.254: U1.32 32.75,31.5 30.96,29.72 R20.2 30.2,29.73 30.2,32.03 27.86,34.37 Q3.3
MISO  (via drill 0.3 pad 0.51)
  Top 0.254: v43.05,24.89 41.4,24.89 39.24,27.05 33.83,27.05 28.45,32.44 JP2.P$1
  Bottom 0.203: 43.03,24.92 v43.05,24.89
  Bottom 0.254: U1.16 43.03,24.92
N$1  (via drill 0.3 pad 0.3)
  Top 0.203: U12.4 39.18,19.37 v38.99,19.18 | R7.1 36.14,14.81 37.08,13.87 37.08,12.87 U10.C7 37.11,11.53 37.39,11.25 39.9,11.25 40.26,11.61 40.26,13.97 40.56,14.28 40.56,16.82 42.98,19.23 v43.92,19.23 44.02,19.23
  Bottom 0.203: v38.99,19.18 43.87,19.18 v43.92,19.23
N$2
  Bottom 0.254: 28.44,23.91 Q2.1 28.18,23.66
  Bottom 0.406: 28.44,23.91 28.44,25.1 R13.1 | R3.2 28.39,20.22 Q2.1
N$3
  Top 0.203: U10.C2 39.65,14.85 R1.1
N$5
  Bottom 0.203: U1.8 41.53,33.73 42.48,34.67
N$6
  cutout Top: 18.8,11.81 18.8,5.71 24.77,5.71 24.64,11.81
N$7
  Top 0.203: R5.1 38.38,14.95 U10.C3
N$8
  Bottom 0.203: U1.7 40.73,34.01 40.08,34.67
N$9
  Bottom 0.406: U3.P$6 25.21,24 R9.1
N$10  (via drill 0.3 pad 0.25)
  Top 0.203: v24.38,3.68 23.37,3.68 22.99,3.3 22.99,1.99 U9.P$10
  Bottom 0.203: v24.38,3.68 24,3.3 23.07,3.3 R8.2
N$12  (via drill 0.3 pad 0.25)
  Top 0.305: U9.P$9 21.97,3.48 21.57,3.89 19.1,3.89 v19,3.99
  Bottom 0.305: R14.2 20.23,3.99 v19,3.99
N$13  (via drill 0.3 pad 0.51)
  Top 0.254: U9.P$1
  Top 0.305: U9.P$1 13.97,3.46 15.24,4.72 29.41,4.72 30.35,5.66 v30.35,21.72
  Bottom 0.203: Q2.3 30.31,21.76 v30.35,21.72
N$14
  Bottom 0.406: R4.1 15.76,36.79 16.12,36.43 U11.1
N$15
  Bottom 0.406: R11.1 21.05,15.43 U2.P$6
N$16
  Bottom 0.305: U11.5 16.32,33.98 17.22,34.87 18.59,34.87 18.9,34.57 18.9,33.71 19.1,33.5 21.13,33.5 21.29,33.66 R10.2
N$17
  Bottom 0.305: D1.C D3.A 13.69,35.09 R4.2
N$18  (via drill 0.38 pad 0.81)
  Top 0.406: MICRO_USB.VBUS1 13.87,31.58 13.28,30.99 v12.29,30.99
  Bottom 0.406: D2.A 9.73,33.73 9.93,33.53 9.93,32.69 11.63,30.99 v12.29,30.99 12.34,31.04 v13.34,31.04 13.23,30.94
N$19
  cutout Bottom: 10.95,16.54 10.95,10.01 17.37,10.01 17.37,16.54
N$20
  Top 0.203: U$7.FEED
  Top 0.254: 4.6,4.96 U$7.FEED | L1.2 2.95,3.17 3.33,3.56 4.47,3.56 C4.2
  Top 0.305: 4.47,3.56 U$7.FEED
N$21  (via drill 0.3 pad 0.41)
  other vias: 3.84,5.08
N$22
  Bottom 0.203: 13.34,32.66 12.93,32.66 10.7,34.9 10.7,35.28
  Bottom 0.254: D1.A 11.35,36.95 | 13.34,32.66 16.66,32.66 17.83,33.83 U11.4 | 10.7,35.28 10.7,36.95
  Bottom 0.406: D2.C 8.73,36.79 C10.1 10.7,36.95 D1.A
N$23  (via drill 0.3 pad 0.41)
  other vias: 5.11,5.08
N$24
  cutout Top: 36.32,1.52 44.58,1.52 44.45,1.52
N$25
  cutout Bottom: 18.77,11.94 18.77,5.66 24.79,5.66 24.79,11.96 18.75,11.96
N$27
  Bottom 0.508: R6.2 21.02,20.17 Q1.1 21.03,21.37 21.03,24.46 20.47,25.02 R12.2
N$28
  cutout Bottom: 36.2,1.4 44.83,1.4 44.7,1.4
N$29
  cutout Top: 0.25,31.62 9.27,31.62 9.27,3.05 0.25,3.05
N$30
  Bottom 0.61: U4.P$6 14.41,25.02 R16.1
N$31
  cutout Bottom: 0.25,31.62 9.14,31.62 9.14,3.05 0.25,3.05
N$32
  cutout Top: 12.57,3.43 29.46,3.43 29.46,0.86 12.57,0.86
N$34
  cutout Top: 13.21,27.18 13.21,24.77 30.73,24.77 30.73,27.18
N$35
  cutout Top: 9.04,22.61 10.85,22.61 11,5.41 8.97,5.41
N$36
  cutout Top: 32.89,22.48 32.89,5.46 35.05,5.46 35.05,22.48
N$38
  cutout Top: 10.92,16.51 10.92,9.96 17.4,10.03 17.4,16.51
N$39
  Bottom 0.254: R18.1 13.08,4.83
  Bottom 0.406: U5.P$6 12.99,6.22 R18.1
N$40
  Bottom 0.406: D4.C 16.73,24.08 18.97,24.08 19.6,23.45 Q1.3
N$41
  Bottom 0.508: D4.A 17.39,22.07 R15.2
N$43
  Bottom 0.305: U8.P$11 R19.2 26.1,31.21 Q3.2
N$46
  Bottom 0.254: U8.P$6 22.84,32.59 22.68,32.74 21.92,32.74 21.59,33.07 19.46,33.07 18.9,32.51 17.49,32.51 R21.2
  Bottom 0.305: Q4.2 16.7,31.52 R21.2
N$48
  Bottom 0.305: U8.P$4 R23.2 20.28,30.44 Q5.2
NETLIGHT  (via drill 0.38 pad 0.81)
  Top 0.406: 10.39,21.97 U9.P$52 9.97,22.52 12.9,25.45 12.9,26.59 13.72,27.41 v13.72,27.53
  Bottom 0.406: R12.1 15.79,25.67 15.24,26.21 14.17,26.21 13.82,26.57 13.82,27.43 v13.72,27.53
RESET  (via drill 0.38 pad 0.81)
  Top 0.305: 34.8,35.31 v34.8,35.05 34.8,35.69 34.54,35.94 31.62,35.94 JP2.P$5
  Bottom 0.254: R2.1 33.66,33.55 35.33,32.05 35.71,31.67 35.71,29.36 35.45,29.1 U1.29
  Bottom 0.305: v34.8,35.05 33.74,35.05 R2.1
RF_ANT
  Top 0.305: C4.1 6.12,3.17 L2.2 10.67,3.17 11.96,4.47 11.96,13.56 11.81,13.72 11.56,13.97 U9.P$60
RXD
  Bottom 0.203: U1.14 44,27.5 44.32,27.18 44.32,21.84 44.07,21.59 35.94,21.59 34.16,19.81 34.16,6.73 33.4,5.97 25.53,5.97 25.27,5.71 25.27,2.29 24.68,1.69 R8.1
SCK  (via drill 0.3 pad 0.51)
  Top 0.254: v40.13,27.56 34.04,27.56 29.72,31.88 JP2.P$3
  Bottom 0.203: U1.17 41.53,25.39 40.66,26.26 40.66,27.2 40.31,27.56 v40.13,27.56 40.26,27.43
SCL  (via drill 0.3 pad 0.61)
  Top 0.254: 31.62,28.22 v31.7,28.3 31.6,28.4 v26.98,28.4
  Bottom 0.254: 26.98,28.24 v26.98,28.4 26.8,28.42 19.62,28.42 Q5.3 | v31.7,28.3 30.3,28.3 R24.2
  Bottom 0.305: U1.28 v31.7,28.3 30.19,28.3 R24.2
SDA  (via drill 0.3 pad 0.61)
  Top 0.254: v24.64,27.74 31.19,27.74 v31.94,26.99
  Bottom 0.254: Q4.3 16.78,27.2 24.11,27.2 v24.64,27.74
  Bottom 0.305: U1.27 32.45,27.5 v31.94,26.99 31.62,26.67 R22.2
SIM900_GAT  (via drill 0.38 pad 0.81)
  Top 0.254: v34.77,24.71 33.91,23.85 22.12,23.85 20.24,21.97 v12.24,21.97
  Bottom 0.254: U1.2 36.73,26.68 v34.77,24.71
  Bottom 0.406: U4.P$5 13.46,22.68 12.75,21.97 v12.24,21.97 12.01,21.97 10.21,20.17 10.21,8.61 11.35,7.47 13.26,7.47 13.84,6.88 U5.P$5
SIM_CLK
  Top 0.203: 41.15,20.32 41.15,21.25 U12.1 | 41.15,20.32 38.35,20.32 37.74,19.71 35.43,19.71 35.17,19.97 U9.P$32 | 41.15,20.32 41.91,20.32 42.16,20.07 42.16,19.05 40.79,17.68 39,17.68 R5.2 38.34,16.85
SIM_DATA  (via drill 0.3 pad 0.3)
  Top 0.203: U9.P$31 37.38,18.97 v37.47,19.05 | 42.65,18.14 v42.85,18.11 42.77,18.11 42.09,17.42 C2.1 41.95,16.85 41.12,16.03 41.12,14.2 41.58,13.74 41.58,11.63 40.13,10.19 37.47,10.19 36.3,11.35 36.3,13.44 35.26,14.48 35.26,16.31 35.8,16.85 R7.2
  Bottom 0.203: v37.47,19.05 37.47,18.41 38.1,17.78 42.44,17.78 v42.85,18.11
SIM_RST  (via drill 0.3 pad 0.3)
  Top 0.203: U9.P$33 36.56,20.97 36.83,20.7 v36.85,20.37 | U12.6 41.15,19.36 41.15,18.67 40.51,18.03 38.61,18.03 38.35,17.78 v37.08,17.78 37.03,17.73 37.03,16.33 37.34,16.03 39.06,16.03 39.89,16.85 R1.2
  Bottom 0.203: v37.08,17.78 36.83,18.03 36.83,20.37 v36.85,20.37
SIM_VDD  (via drill 0.3 pad 0.61)
  Top 0.203: U12.5 40.51,18.54 40.39,18.41 36.45,18.41 36,17.97 v35.88,17.97 U9.P$30 | 45.06,17.27 45.06,21.82 44.07,22.81 40.46,22.81 39.62,23.65 38.81,23.65 37.77,22.61 v37.77,20.95 | C5.1 44.64,16.85 45.06,17.27 | U10.C1 42.19,11.94 42.62,11.51 43.89,11.51 44.25,11.86 44.25,13.41 45.06,14.22 45.06,17.27
  Bottom 0.203: v35.88,17.97 35.92,18.01 35.92,20.73 36.22,21.03 37.69,21.03 v37.77,20.95
TXD  (via drill 0.3 pad 0.25, 0.3 pad 0.61)
  Top 0.254: v29.18,37.29 29.72,36.65 JP2.P$4 | v30.45,33.33 30.45,31.83 33.96,28.32 40.87,28.32 v41.66,27.53
  Bottom 0.203: R14.1 21.5,1.69 21.84,2.03 21.84,4.19 22.23,4.57 24.38,4.57 24.77,4.95 24.77,6.1 25.15,6.48 32.77,6.48 33.4,7.11 33.4,19.68 35.69,21.97 43.69,21.97 43.94,22.23 43.94,26.54 43.78,26.7 U1.15 43,26.67
  Bottom 0.254: 30.38,33.12 v30.45,33.33 30.45,36.12 29.29,37.29 v29.18,37.29 | 43,26.67 41.96,26.67 41.68,26.95 41.68,27.51 v41.66,27.53
VBAT  (via drill 0.38 pad 0.81, 0.51 pad 1.02)
  Top 0.406: U$4.P$1 34.69,38 27.96,38 27.79,37.82
  Top 0.61: JP3.1 4.95,34.04 6.35,32.64 9.91,32.64 10.72,31.83 10.72,28.88 v10.54,28.7 | U6.P$3 23.11,34.19 24.03,35.1 24.03,35.75 C9.1 24.02,35.84 25.65,35.84 26.04,36.22 26.04,36.88 v26.92,37.77 26.98,37.82 27.69,37.82 | U$4.P$2 v37.97,37.28 U$4.P$1 | 27.69,37.82 27.79,37.82 27.84,37.82 | JP2.P$2 27.69,37.34 27.69,37.82
  Bottom 0.254: 18.22,37.28 18.22,37.27
  Bottom 0.305: U1.6 39.94,32.06 39.17,31.29 39.17,31.22 | U1.4 38.34,32.02 38.61,31.75 38.63,31.75 39.17,31.22 | 38.34,35.41 38.57,35.65 C12.1 38.57,37.2 38.48,37.28 v37.97,37.28 | U1.18 40.73,25.36 39.17,26.92 39.17,31.22
  Bottom 0.406: 38.34,35.41 U1.4 | R2.2 34.27,37.28 v37.97,37.28
  Bottom 0.61: JP3.1 4.95,36.58 6.22,37.85 17.78,37.85 18.22,37.4 | U11.3 18.22,37.27 | 18.22,37.28 18.22,37.4 | v26.92,37.77 26.87,37.82 20.18,37.82 C3.1 18.27,37.45 18.22,37.4 | 11.18,28.19 11.18,26.45 R16.2 12.51,25.02 U4.P$4 | U3.P$4 23.31,23.9 arc-90 R9.2 23.24,24.17 23.24,25.44 | R20.1 R24.1 R22.1 24.64,26.67 23.41,25.44 23.24,25.44 | 23.24,25.44 21.65,25.44 20.68,26.42 16.43,26.42 15.9,26.95 15.11,26.95 14.71,27.36 14.71,28.25 14.25,28.7 v11.94,28.7
  other vias: 10.54,27.18 11.94,27.18
  pour Top: 10.03,29.46 10.03,26.54 12.45,26.54 12.45,29.46
  pour Bottom: 9.91,29.72 9.91,26.29 12.57,26.29 12.57,29.72
(copper drawn outside any net)
  shapes: Bottom area x8

### Text on the board
tPlace: _ | +